# Altium schematic sheet scb_connectors.SchDoc: SCB connectors
size 297 x 209 mm; DrawnBy: TW; Engineer: TW
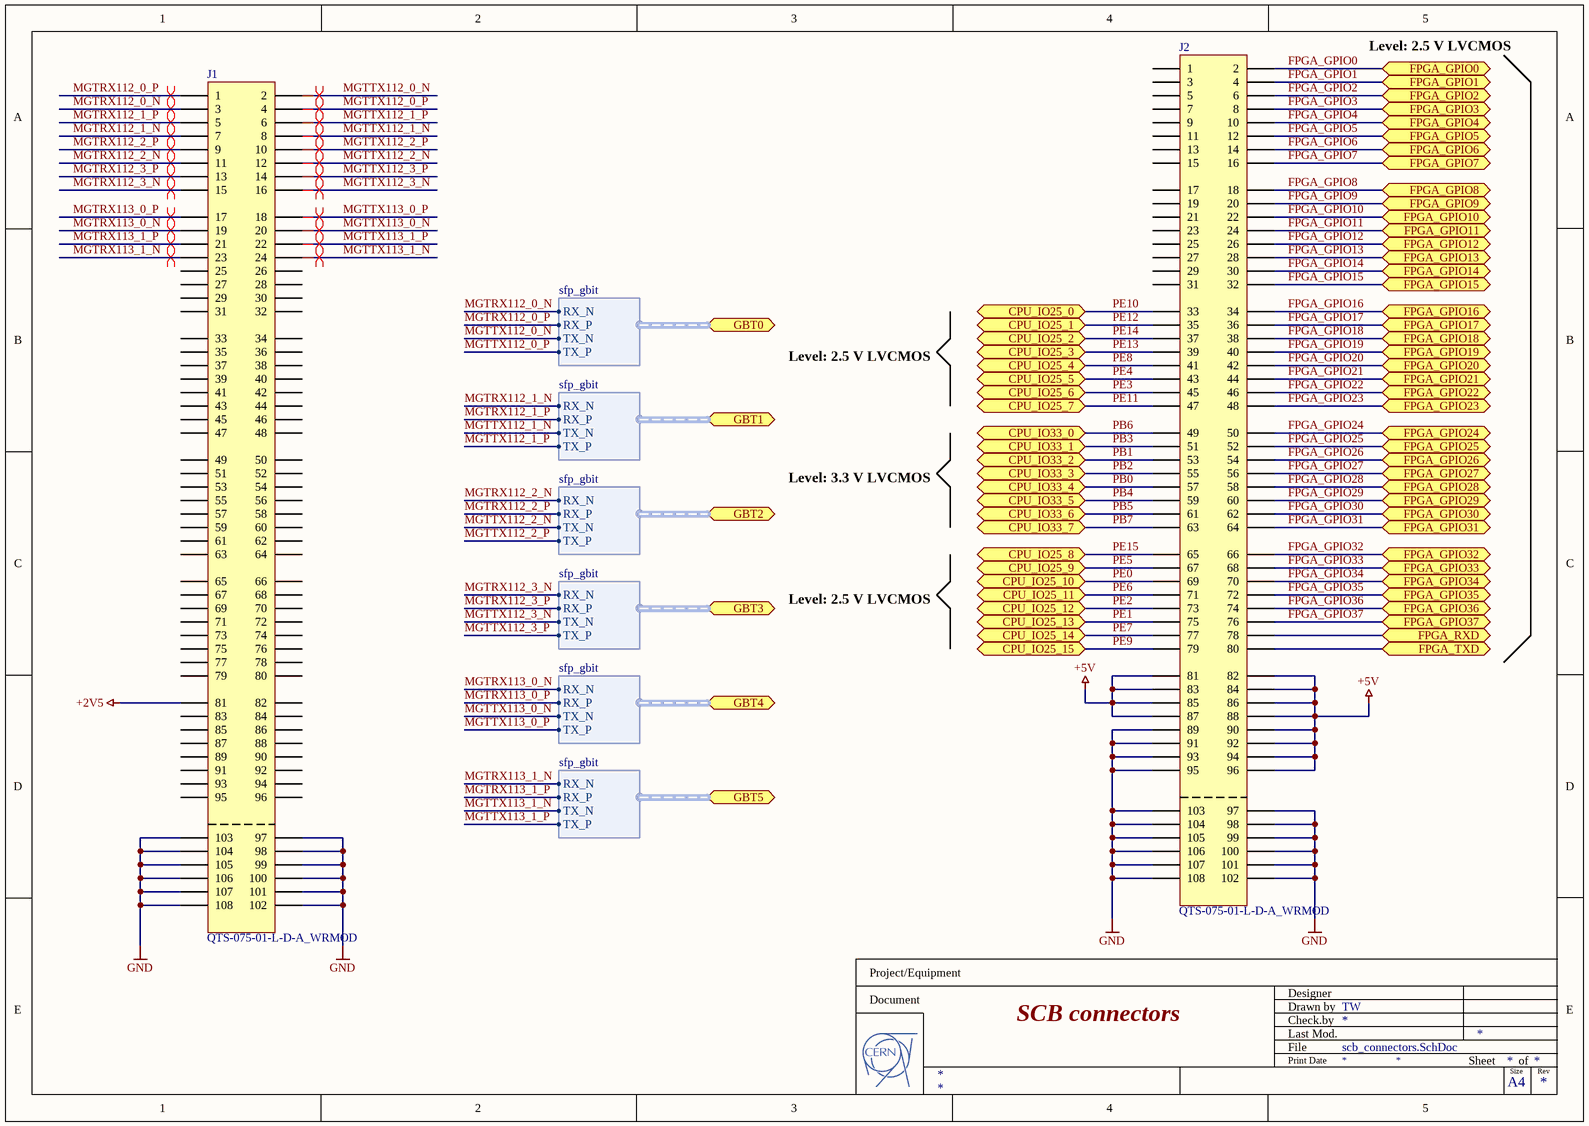
[diagram p0: scb_connectors.SchDoc]

## Parts
J1  QTS-075-01-L-D-A_WRMOD  [QTS-075-01-L-D-A_WRMOD]
J2  QTS-075-01-L-D-A_WRMOD  [QTS-075-01-L-D-A_WRMOD]

## Ports
CPU_IO25_0 (bidir), CPU_IO25_1 (bidir), CPU_IO25_2 (bidir), CPU_IO25_3 (bidir), CPU_IO25_4 (bidir), CPU_IO25_5 (bidir), CPU_IO25_6 (bidir), CPU_IO25_7 (bidir), CPU_IO25_8 (bidir), CPU_IO25_9 (bidir), CPU_IO25_10 (bidir), CPU_IO25_11 (bidir), CPU_IO25_12 (bidir), CPU_IO25_13 (bidir), CPU_IO25_14 (bidir), CPU_IO25_15 (bidir), CPU_IO33_0 (bidir), CPU_IO33_1 (bidir), CPU_IO33_2 (bidir), CPU_IO33_3 (bidir), CPU_IO33_4 (bidir), CPU_IO33_5 (bidir), CPU_IO33_6 (bidir), CPU_IO33_7 (bidir), FPGA_GPIO0 (bidir), FPGA_GPIO1 (bidir), FPGA_GPIO2 (bidir), FPGA_GPIO3 (bidir), FPGA_GPIO4 (bidir), FPGA_GPIO5 (bidir), FPGA_GPIO6 (bidir), FPGA_GPIO7 (bidir), FPGA_GPIO8 (bidir), FPGA_GPIO9 (bidir), FPGA_GPIO10 (bidir), FPGA_GPIO11 (bidir), FPGA_GPIO12 (bidir), FPGA_GPIO13 (bidir), FPGA_GPIO14 (bidir), FPGA_GPIO15 (bidir), FPGA_GPIO16 (bidir), FPGA_GPIO17 (bidir), FPGA_GPIO18 (bidir), FPGA_GPIO19 (bidir), FPGA_GPIO20 (bidir), FPGA_GPIO21 (bidir), FPGA_GPIO22 (bidir), FPGA_GPIO23 (bidir), FPGA_GPIO24 (bidir), FPGA_GPIO25 (bidir), FPGA_GPIO26 (bidir), FPGA_GPIO27 (bidir), FPGA_GPIO28 (bidir), FPGA_GPIO29 (bidir), FPGA_GPIO30 (bidir), FPGA_GPIO31 (bidir), FPGA_GPIO32 (bidir), FPGA_GPIO33 (bidir), FPGA_GPIO34 (bidir), FPGA_GPIO35 (bidir), FPGA_GPIO36 (bidir), FPGA_GPIO37 (bidir), FPGA_RXD (bidir), FPGA_TXD (bidir), GBT0 (harness sfp_gbit), GBT1 (harness sfp_gbit), GBT2 (harness sfp_gbit), GBT3 (harness sfp_gbit), GBT4 (harness sfp_gbit), GBT5 (harness sfp_gbit)

## Harnesses
sfp_gbit: RX_N, RX_P, TX_N, TX_P

## Nets
+2V5: J1.81
+5V: J2.81 J2.82 J2.83 J2.84 J2.85 J2.86 J2.87 J2.88 J2.90 J2.92 J2.94 J2.96
GND: J1.97 J1.98 J1.99 J1.100 J1.101 J1.102 J1.103 J1.104 J1.105 J1.106 J1.107 J1.108 J2.89 J2.91 J2.93 J2.95 J2.97 J2.98 J2.99 J2.100 J2.101 J2.102 J2.103 J2.104 J2.105 J2.106 J2.107 J2.108
FPGA_GPIO0: J2.2 ; port FPGA_GPIO0
FPGA_GPIO1: J2.4 ; port FPGA_GPIO1
FPGA_GPIO2: J2.6 ; port FPGA_GPIO2
FPGA_GPIO3: J2.8 ; port FPGA_GPIO3
FPGA_GPIO4: J2.10 ; port FPGA_GPIO4
FPGA_GPIO5: J2.12 ; port FPGA_GPIO5
FPGA_GPIO6: J2.14 ; port FPGA_GPIO6
FPGA_GPIO7: J2.16 ; port FPGA_GPIO7
FPGA_GPIO8: J2.18 ; port FPGA_GPIO8
FPGA_GPIO9: J2.20 ; port FPGA_GPIO9
FPGA_GPIO10: J2.22 ; port FPGA_GPIO10
FPGA_GPIO11: J2.24 ; port FPGA_GPIO11
FPGA_GPIO12: J2.26 ; port FPGA_GPIO12
FPGA_GPIO13: J2.28 ; port FPGA_GPIO13
FPGA_GPIO14: J2.30 ; port FPGA_GPIO14
FPGA_GPIO15: J2.32 ; port FPGA_GPIO15
FPGA_GPIO16: J2.34 ; port FPGA_GPIO16
FPGA_GPIO17: J2.36 ; port FPGA_GPIO17
FPGA_GPIO18: J2.38 ; port FPGA_GPIO18
FPGA_GPIO19: J2.40 ; port FPGA_GPIO19
FPGA_GPIO20: J2.42 ; port FPGA_GPIO20
FPGA_GPIO21: J2.44 ; port FPGA_GPIO21
FPGA_GPIO22: J2.46 ; port FPGA_GPIO22
FPGA_GPIO23: J2.48 ; port FPGA_GPIO23
FPGA_GPIO24: J2.50 ; port FPGA_GPIO24
FPGA_GPIO25: J2.52 ; port FPGA_GPIO25
FPGA_GPIO26: J2.54 ; port FPGA_GPIO26
FPGA_GPIO27: J2.56 ; port FPGA_GPIO27
FPGA_GPIO28: J2.58 ; port FPGA_GPIO28
FPGA_GPIO29: J2.60 ; port FPGA_GPIO29
FPGA_GPIO30: J2.62 ; port FPGA_GPIO30
FPGA_GPIO31: J2.64 ; port FPGA_GPIO31
FPGA_GPIO32: J2.66 ; port FPGA_GPIO32
FPGA_GPIO33: J2.68 ; port FPGA_GPIO33
FPGA_GPIO34: J2.70 ; port FPGA_GPIO34
FPGA_GPIO35: J2.72 ; port FPGA_GPIO35
FPGA_GPIO36: J2.74 ; port FPGA_GPIO36
FPGA_GPIO37: J2.76 ; port FPGA_GPIO37
FPGA_RXD: J2.78 ; port FPGA_RXD
FPGA_TXD: J2.80 ; port FPGA_TXD
MGTRX112_0_N: J1.3 ; port GBT0.RX_N
MGTRX112_0_P: J1.1 ; port GBT0.RX_P
MGTRX112_1_N: J1.7 ; port GBT1.RX_N
MGTRX112_1_P: J1.5 ; port GBT1.RX_P
MGTRX112_2_N: J1.11 ; port GBT2.RX_N
MGTRX112_2_P: J1.9 ; port GBT2.RX_P
MGTRX112_3_N: J1.15 ; port GBT3.RX_N
MGTRX112_3_P: J1.13 ; port GBT3.RX_P
MGTRX113_0_N: J1.19 ; port GBT4.RX_N
MGTRX113_0_P: J1.17 ; port GBT4.RX_P
MGTRX113_1_N: J1.23 ; port GBT5.RX_N
MGTRX113_1_P: J1.21 ; port GBT5.RX_P
MGTTX112_0_N: J1.2 ; port GBT0.TX_N
MGTTX112_0_P: J1.4 ; port GBT0.TX_P
MGTTX112_1_N: J1.8 ; port GBT1.TX_N
MGTTX112_1_P: J1.6 ; port GBT1.TX_P
MGTTX112_2_N: J1.12 ; port GBT2.TX_N
MGTTX112_2_P: J1.10 ; port GBT2.TX_P
MGTTX112_3_N: J1.16 ; port GBT3.TX_N
MGTTX112_3_P: J1.14 ; port GBT3.TX_P
MGTTX113_0_N: J1.20 ; port GBT4.TX_N
MGTTX113_0_P: J1.18 ; port GBT4.TX_P
MGTTX113_1_N: J1.24 ; port GBT5.TX_N
MGTTX113_1_P: J1.22 ; port GBT5.TX_P
PB0: J2.57 ; port CPU_IO33_4
PB1: J2.53 ; port CPU_IO33_2
PB2: J2.55 ; port CPU_IO33_3
PB3: J2.51 ; port CPU_IO33_1
PB4: J2.59 ; port CPU_IO33_5
PB5: J2.61 ; port CPU_IO33_6
PB6: J2.49 ; port CPU_IO33_0
PB7: J2.63 ; port CPU_IO33_7
PE0: J2.69 ; port CPU_IO25_10
PE1: J2.75 ; port CPU_IO25_13
PE2: J2.73 ; port CPU_IO25_12
PE3: J2.45 ; port CPU_IO25_6
PE4: J2.43 ; port CPU_IO25_5
PE5: J2.67 ; port CPU_IO25_9
PE6: J2.71 ; port CPU_IO25_11
PE7: J2.77 ; port CPU_IO25_14
PE8: J2.41 ; port CPU_IO25_4
PE9: J2.79 ; port CPU_IO25_15
PE10: J2.33 ; port CPU_IO25_0
PE11: J2.47 ; port CPU_IO25_7
PE12: J2.35 ; port CPU_IO25_1
PE13: J2.39 ; port CPU_IO25_3
PE14: J2.37 ; port CPU_IO25_2
PE15: J2.65 ; port CPU_IO25_8

Not connected (* = marked no-connect by the designer): J1 25 26 27 28 29 30 31 32 33 34 35 36 37 38 39 40 41 42 43 44 45 46 47 48 49 50 51 52 53 54 55 56 57 58 59 60 61 62 63 64 65 66 67 68 69 70 71 72 73 74 75 76 77 78 79 80 82 83 84 85 86 87 88 89 90 91 92 93 94 95 96; J2 1 3 5 7 9 11 13 15 17 19 21 23 25 27 29 31

## Layout directives
differential pair: MGTRX112_0_N, MGTRX112_0_P, MGTRX112_1_N, MGTRX112_1_P, MGTRX112_2_N, MGTRX112_2_P, MGTRX112_3_N, MGTRX112_3_P, MGTRX113_0_N, MGTRX113_0_P, MGTRX113_1_N, MGTRX113_1_P, MGTTX112_0_N, MGTTX112_0_P, MGTTX112_1_N, MGTTX112_1_P, MGTTX112_2_N, MGTTX112_2_P, MGTTX112_3_N, MGTTX112_3_P, MGTTX113_0_N, MGTTX113_0_P, MGTTX113_1_N, MGTTX113_1_P

## Notes on the sheet
- Level: 2.5 V LVCMOS
- Level: 3.3 V LVCMOS
- Project/Equipment
- Document
- Designer
- Drawn by
- Check.by
- File
- Last Mod.
- Print Date
- Sheet
- Size
- A4
- of
- Rev

## Library data of the parts
J1 J2 = QTS-075-01-L-D-A_WRMOD: High Speed Ground Plane Header